# EAGLE design Actuator_Control_board (EAGLE 8.5.1)
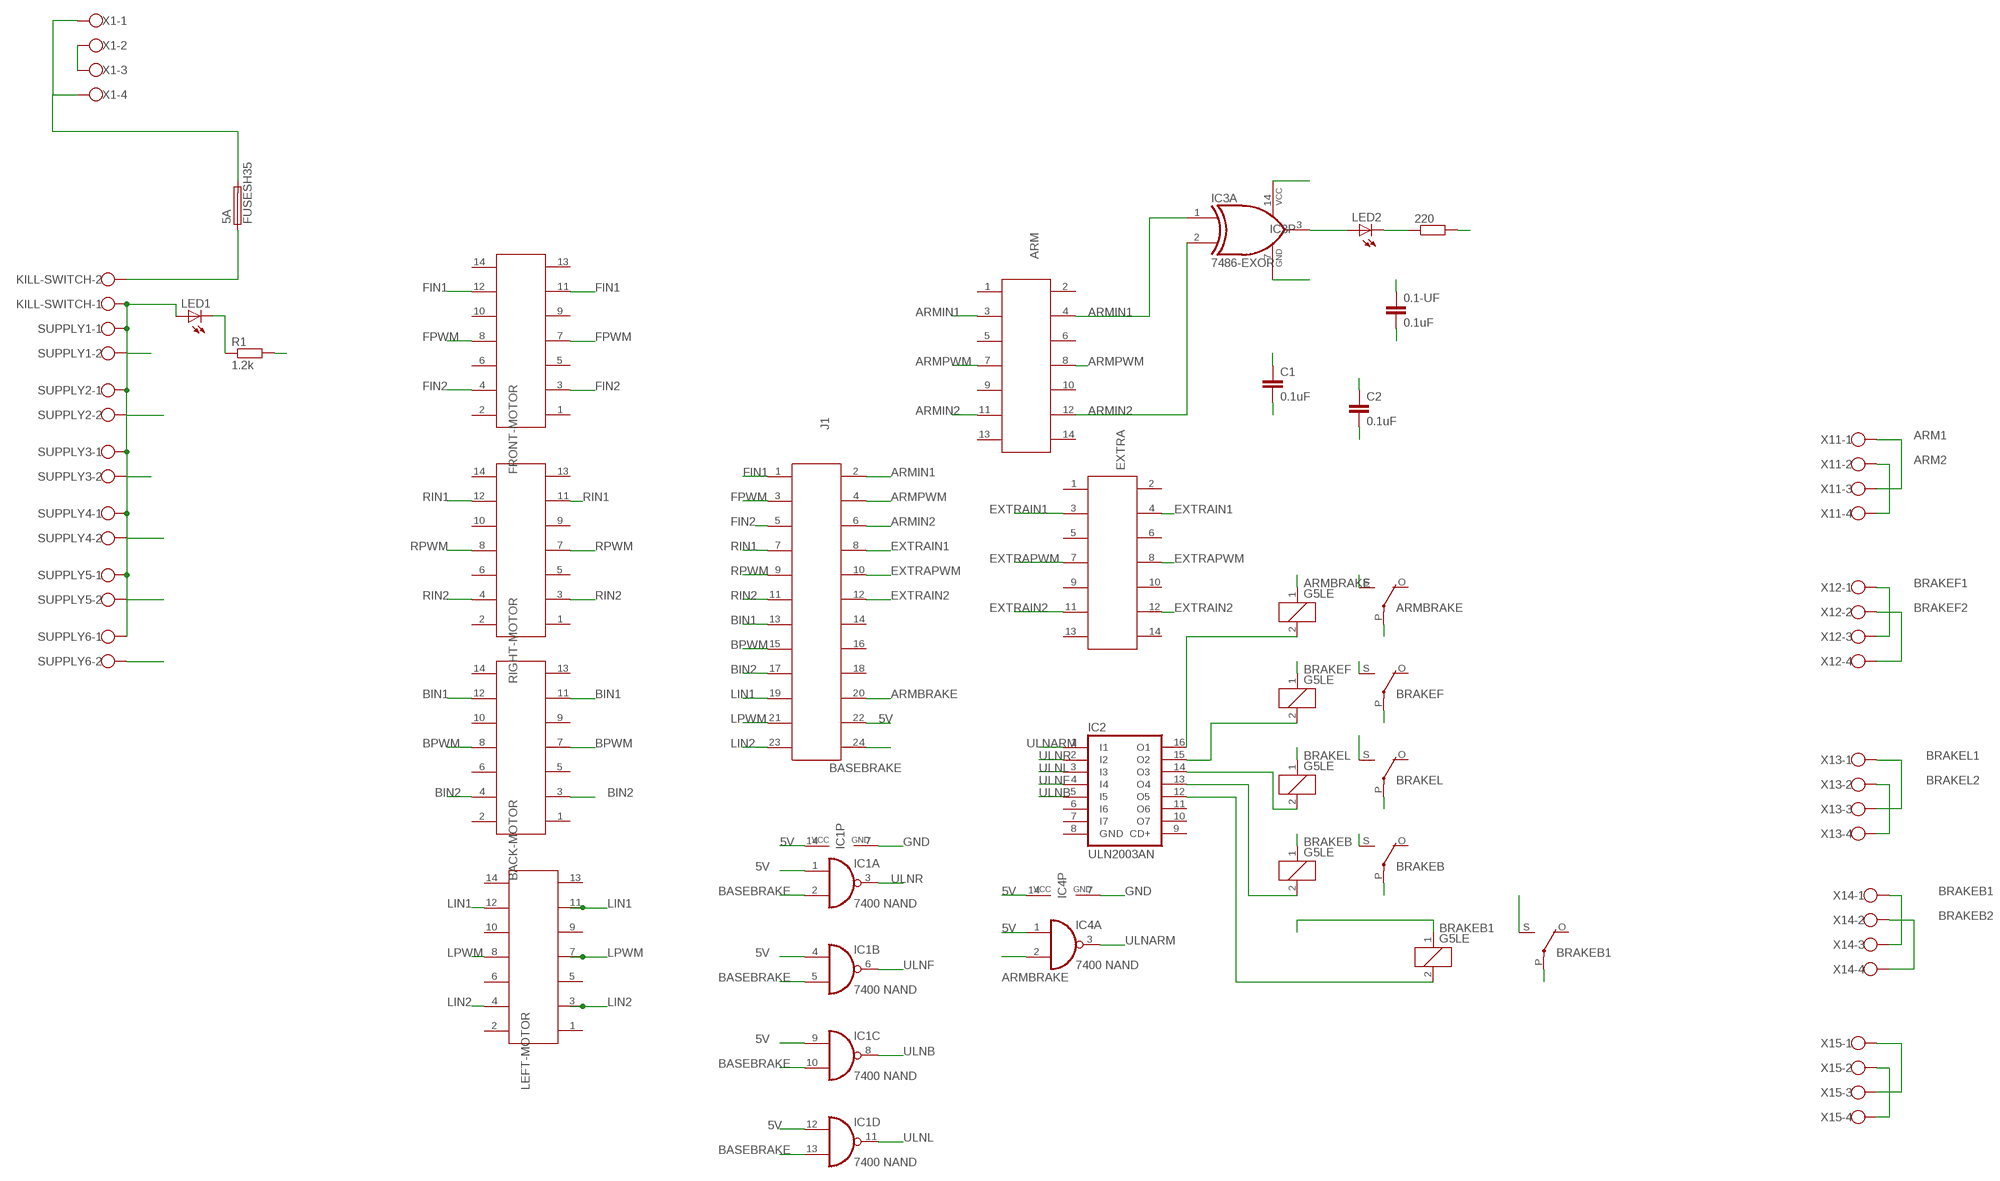
[diagram p0: schematic, sheet 1]

## Parts
0.1-UF  0.1uF  C5/2.5  [C5B2.5]
5A  FUSESH35  [SH25]
220  R-EU_0207/10  [0207/10]
ARM  61201421621  [61201421621]
ARMBRAKE  G5LE  [G5LE]
BACK-MOTOR  61201421621  [61201421621]
BRAKEB  G5LE  [G5LE]
BRAKEB1  G5LE  [G5LE]
BRAKEF  G5LE  [G5LE]
BRAKEL  G5LE  [G5LE]
C1  0.1uF  C5/2.5  [C5B2.5]
C2  0.1uF  C5/2.5  [C5B2.5]
EXTRA  61201421621  [61201421621]
FRONT-MOTOR  61201421621  [61201421621]
IC1  7400 NAND  74AC00N  [DIL14]
IC2  ULN2003AN  [DIL16]
IC3  7486-EXOR  74LS86N  [DIL14]
IC4  7400 NAND  74AC00N  [DIL14]
J1  61202421621  [61202421621]
KILL-SWITCH  W237-102  [W237-102]
LED1  LED5MM  [LED5MM]
LED2  LED5MM  [LED5MM]
LEFT-MOTOR  61201421621  [61201421621]
R1  1.2k  R-EU_0617/17  [0617/17]
RIGHT-MOTOR  61201421621  [61201421621]
SUPPLY1  W237-102  [W237-102]
SUPPLY2  W237-102  [W237-102]
SUPPLY3  W237-102  [W237-102]
SUPPLY4  W237-102  [W237-102]
SUPPLY5  W237-102  [W237-102]
SUPPLY6  W237-102  [W237-102]
X1  W237-4  [W237-4]
X11  W237-4  [W237-4]
X12  W237-4  [W237-4]
X13  W237-4  [W237-4]
X14  W237-4  [W237-4]
X15  W237-4  [W237-4]

## Nets
5V: 0.1-UF.1 ARMBRAKE.1 BRAKEB1.1 BRAKEB.1 BRAKEF.1 BRAKEL.1 C1.1 C2.1 IC1.1(A:I0) IC1.4(B:I0) IC1.9(C:I0) IC1.12(D:I0) IC1.14(P:VCC) IC3.14(P:VCC) IC4.1(A:I0) IC4.14(P:VCC) J1.22
ARM1: ARMBRAKE.P(2:P) X11.1 X11.3
ARM2: ARMBRAKE.S(2:S) X11.2 X11.4
ARMBRAKE: IC4.2(A:I1) J1.20
ARMIN1: ARM.3 ARM.4 IC3.1(A:I0) J1.2
ARMIN2: ARM.11 ARM.12 IC3.2(A:I1) J1.6
ARMPWM: ARM.7 ARM.8 J1.4
BASEBRAKE: IC1.2(A:I1) IC1.5(B:I1) IC1.10(C:I1) IC1.13(D:I1) J1.24
BIN1: BACK-MOTOR.11 BACK-MOTOR.12 J1.13
BIN2: BACK-MOTOR.3 BACK-MOTOR.4 J1.17
BPWM: BACK-MOTOR.7 BACK-MOTOR.8 J1.15
BRAKEB1: BRAKEB.P(2:P) X14.1 X14.3
BRAKEB2: BRAKEB.S(2:S) X14.2 X14.4
BRAKEF1: BRAKEF.P(2:P) X12.1 X12.3
BRAKEF2: BRAKEF.S(2:S) X12.2 X12.4
BRAKEL1: BRAKEL.P(2:P) X13.1 X13.3
BRAKEL2: BRAKEL.S(2:S) X13.2 X13.4
BRAKER1: BRAKEB1.P(2:P) X15.1 X15.3
BRAKER2: BRAKEB1.S(2:S) X15.2 X15.4
EXTRAIN1: EXTRA.3 EXTRA.4 J1.8
EXTRAIN2: EXTRA.11 EXTRA.12 J1.12
EXTRAPWM: EXTRA.7 EXTRA.8 J1.10
FIN1: FRONT-MOTOR.11 FRONT-MOTOR.12 J1.1
FIN2: FRONT-MOTOR.3 FRONT-MOTOR.4 J1.5
FPWM: FRONT-MOTOR.7 FRONT-MOTOR.8 J1.3
GND: 0.1-UF.2 220.2 C1.2 C2.2 IC1.7(P:GND) IC3.7(P:GND) IC4.7(P:GND) R1.2 SUPPLY1.2 SUPPLY2.2 SUPPLY3.2 SUPPLY4.2 SUPPLY5.2 SUPPLY6.2 X1.2 X1.3
LIN1: J1.19 LEFT-MOTOR.11 LEFT-MOTOR.12
LIN2: J1.23 LEFT-MOTOR.3 LEFT-MOTOR.4
LPWM: J1.21 LEFT-MOTOR.7 LEFT-MOTOR.8
N$1: ARMBRAKE.2 IC2.16(O1)
N$2: BRAKEF.2 IC2.15(O2)
N$3: BRAKEL.2 IC2.14(O3)
N$5: BRAKEB.2 IC2.13(O4)
N$6: BRAKEB1.2 IC2.12(O5)
N$8: 5A.2 X1.1 X1.4
N$9: 5A.1 KILL-SWITCH.2
N$10: KILL-SWITCH.1 LED1.A SUPPLY1.1 SUPPLY2.1 SUPPLY3.1 SUPPLY4.1 SUPPLY5.1 SUPPLY6.1
N$11: LED1.K(C) R1.1
N$12: IC3.3(A:O) LED2.A
N$13: 220.1 LED2.K(C)
RIN1: J1.7 RIGHT-MOTOR.11 RIGHT-MOTOR.12
RIN2: J1.11 RIGHT-MOTOR.3 RIGHT-MOTOR.4
RPWM: J1.9 RIGHT-MOTOR.7 RIGHT-MOTOR.8
ULNARM: IC2.1(I1) IC4.3(A:O)
ULNB: IC1.8(C:O) IC2.5(I5)
ULNF: IC1.6(B:O) IC2.4(I4)
ULNL: IC1.11(D:O) IC2.3(I3)
ULNR: IC1.3(A:O) IC2.2(I2)
Unconnected: ARM.1 ARM.2 ARM.5 ARM.6 ARM.9 ARM.10 ARM.13 ARM.14 ARMBRAKE.O(2:O) BACK-MOTOR.1 BACK-MOTOR.2 BACK-MOTOR.5 BACK-MOTOR.6 BACK-MOTOR.9 BACK-MOTOR.10 BACK-MOTOR.13 BACK-MOTOR.14 BRAKEB1.O(2:O) BRAKEB.O(2:O) BRAKEF.O(2:O) BRAKEL.O(2:O) EXTRA.1 EXTRA.2 EXTRA.5 EXTRA.6 EXTRA.9 EXTRA.10 EXTRA.13 EXTRA.14 FRONT-MOTOR.1 FRONT-MOTOR.2 FRONT-MOTOR.5 FRONT-MOTOR.6 FRONT-MOTOR.9 FRONT-MOTOR.10 FRONT-MOTOR.13 FRONT-MOTOR.14 IC2.6(I6) IC2.7(I7) IC2.9(CD+) IC2.10(O7) IC2.11(O6) IC3.4(B:I0) IC3.5(B:I1) IC3.6(B:O) IC3.8(C:O) IC3.9(C:I0) IC3.10(C:I1) IC3.11(D:O) IC3.12(D:I0) IC3.13(D:I1) IC4.4(B:I0) IC4.5(B:I1) IC4.6(B:O) IC4.8(C:O) IC4.9(C:I0) IC4.10(C:I1) IC4.11(D:O) IC4.12(D:I0) IC4.13(D:I1) J1.14 J1.16 J1.18 LEFT-MOTOR.1 LEFT-MOTOR.2 LEFT-MOTOR.5 LEFT-MOTOR.6 LEFT-MOTOR.9 LEFT-MOTOR.10 LEFT-MOTOR.13 LEFT-MOTOR.14 RIGHT-MOTOR.1 RIGHT-MOTOR.2 RIGHT-MOTOR.5 RIGHT-MOTOR.6 RIGHT-MOTOR.9 RIGHT-MOTOR.10 RIGHT-MOTOR.13 RIGHT-MOTOR.14

## Power pins joined to a net without a drawn wire
GND: IC2.8(GND)

## Library data of the parts
0.1-UF C1 C2 = capacitor-wima:C: CAPACITOR naming: grid - package width
5A = fuse:FUSE: Fuse; OC_FARNELL: unknown; OC_NEWARK: unknown
220 R1 = resistor:R-EU_: RESISTOR, European symbol
ARM BACK-MOTOR EXTRA FRONT-MOTOR LEFT-MOTOR RIGHT-MOTOR = Wurth_Elektronik_Electromechanic_Wire_to_Board_Connectors_rev17b:61201421621: WR-BHD 2.54mm Male Box Header, 14 Pins=>Code : Con_WTB_BHD_2.54_Male_THT_WS_61201421621 <http://katalog.we-online.de/media/thumbs2/eican/thb_Con_WTB_BHD_2.54_Male_THT_WS_6120xx21621_pf2.jpg> Details see: http://katalog.we-online.de/en/em/612_0xx_216_21 Created 2014-06-04, Karrer Zheng 2014 (C) Würth Elektronik
ARMBRAKE BRAKEB BRAKEB1 BRAKEF BRAKEL = relay:G5LE: RELAY 1 x switch, 10 A/120 V AC, 8 A/30 V DC, Omron; OC_FARNELL: unknown; OC_NEWARK: unknown
IC1 IC4 = 74xx-eu:74*00: Quad 2-input NAND gate
IC2 = uln-udn:ULN2003A: DRIVER ARRAY
IC3 = 74xx-us:74*86: Quad 2-input EXCLUSIV-OR (XOR) gate
J1 = Wurth_Elektronik_Electromechanic_Wire_to_Board_Connectors_rev17b:61202421621: WR-BHD 2.54mm Male Box Header, 24 Pins=>Code : Con_WTB_BHD_2.54_Male_THT_WS_61202421621 <http://katalog.we-online.de/media/thumbs2/eican/thb_Con_WTB_BHD_2.54_Male_THT_WS_6120xx21621_pf2.jpg> Details see: http://katalog.we-online.de/en/em/612_0xx_216_21 Created 2014-06-04, Karrer Zheng 2014 (C) Würth Elektronik
KILL-SWITCH SUPPLY1-SUPPLY6 = con-wago-500:W237-102: WAGO SCREW CLAMP; MPN: 237-102; OC_FARNELL: unknown; OC_NEWARK: 70K9898
LED1 LED2 = led:LED: LED OSRAM: - CHIPLED LG R971, LG N971, LY N971, LG Q971, LY Q971, LO R971, LY R971 LH N974, LH R974 LS Q976, LO Q976, LY Q976 LO Q996 - Hyper CHIPLED LW Q18S LB Q993, LB Q99A, LB R99A - SideLED LS A670, LO A670, LY A670, LG A670, LP A670 LB A673, LV A673, LT A673, LW A673 LH A674 LY A675 LS A676, LA A676, LO A676, LY A676, LW A676 LS A679, LY A679, LG A679 - Hyper Micro SIDELED® LS Y876, LA Y876, LO Y876, LY Y876 LT Y87S - SmartLED LW L88C, LW L88S LB L89C, LB L89S, LG L890 LS L89K, LO L89K, LY L89K LS L896, LA L896, LO L896, LY L896 - TOPLED LS T670, LO T670, LY T670, LG T670, LP T670 LSG T670, LSP T670, LSY T670, LOP T670, LYG T670 LG T671, LOG T671, LSG T671 LB T673, LV T673, LT T673, LW T673 LH T674 LS T676, LA T676, LO T676, LY T676, LB T676, LH T676, LSB T676, LW T676 LB T67C, LV T67C, LT T67C, LS T67K, LO T67K, LY T67K, LW E67C LS E67B, LA E67B, LO E67B, LY E67B, LB E67C, LV E67C, LT E67C LW T67C LS T679, LY T679, LG T679 LS T770, LO T770, LY T770, LG T770, LP T770 LB T773, LV T773, LT T773, LW T773 LH T774 LS E675, LA E675, LY E675, LS T675 LS T776, LA T776, LO T776, LY T776, LB T776 LHGB T686 LT T68C, LB T68C - Hyper Mini TOPLED® LB M676 - Mini TOPLED Santana® LG M470 LS M47K, LO M47K, LY M47K Source: http://www.osram.convergy.de LUXEON: - LUMILED® LXK2-PW12-R00, LXK2-PW12-S00, LXK2-PW14-U00, LXK2-PW14-V00 LXK2-PM12-R00, LXK2-PM12-S00, LXK2-PM14-U00 LXK2-PE12-Q00, LXK2-PE12-R00, LXK2-PE12-S00, LXK2-PE14-T00, LXK2-PE14-U00 LXK2-PB12-K00, LXK2-PB12-L00, LXK2-PB12-M00, LXK2-PB14-N00, LXK2-PB14-P00, LXK2-PB14-Q00 LXK2-PR12-L00, LXK2-PR12-M00, LXK2-PR14-Q00, LXK2-PR14-R00 LXK2-PD12-Q00, LXK2-PD12-R00, LXK2-PD12-S00 LXK2-PH12-R00, LXK2-PH12-S00 LXK2-PL12-P00, LXK2-PL12-Q00, LXK2-PL12-R00 Source: www.luxeon.com KINGBRIGHT: KA-3528ASYC Source: www.kingbright.com
X1 X11-X15 = con-wago-500:W237-4: WAGO SCREW CLAMP; OC_FARNELL: unknown; OC_NEWARK: unknown

## Board
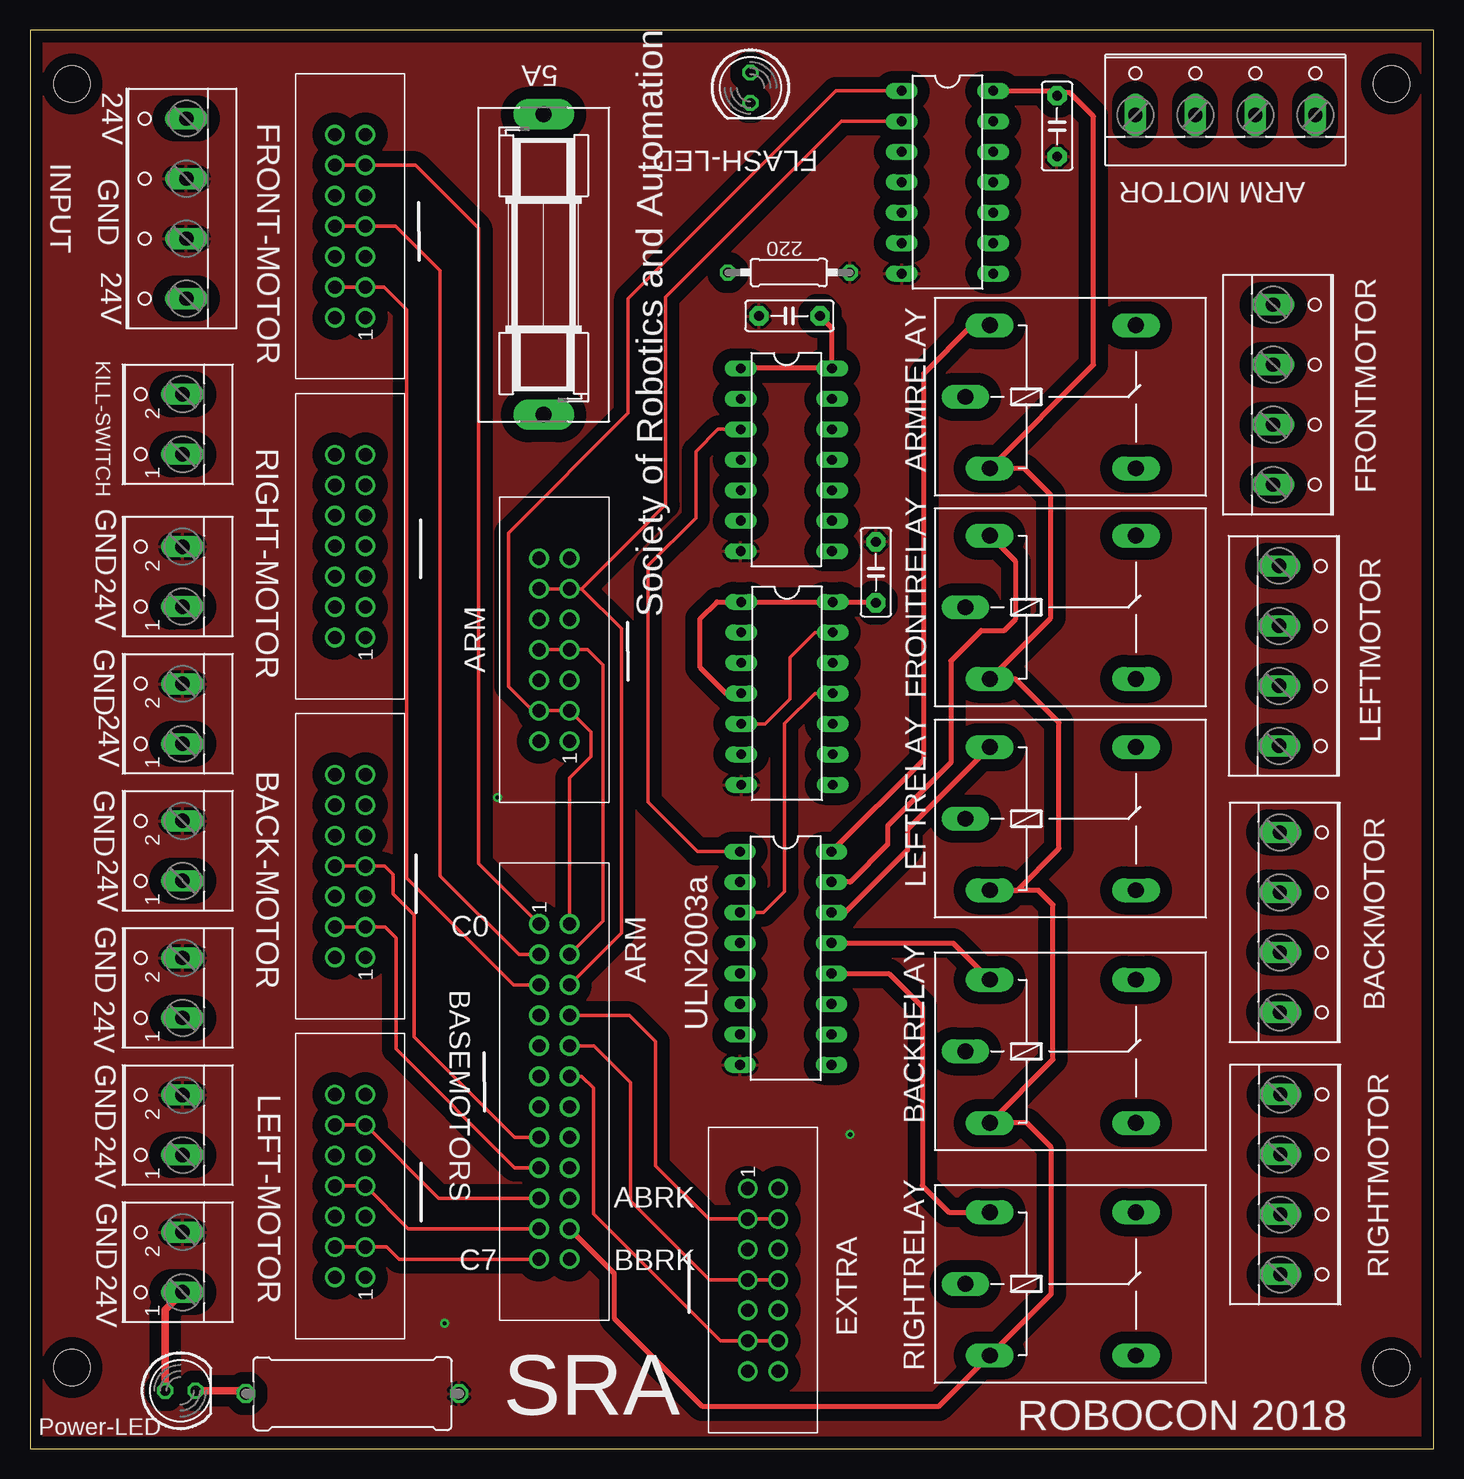
[diagram p1: board, top side]
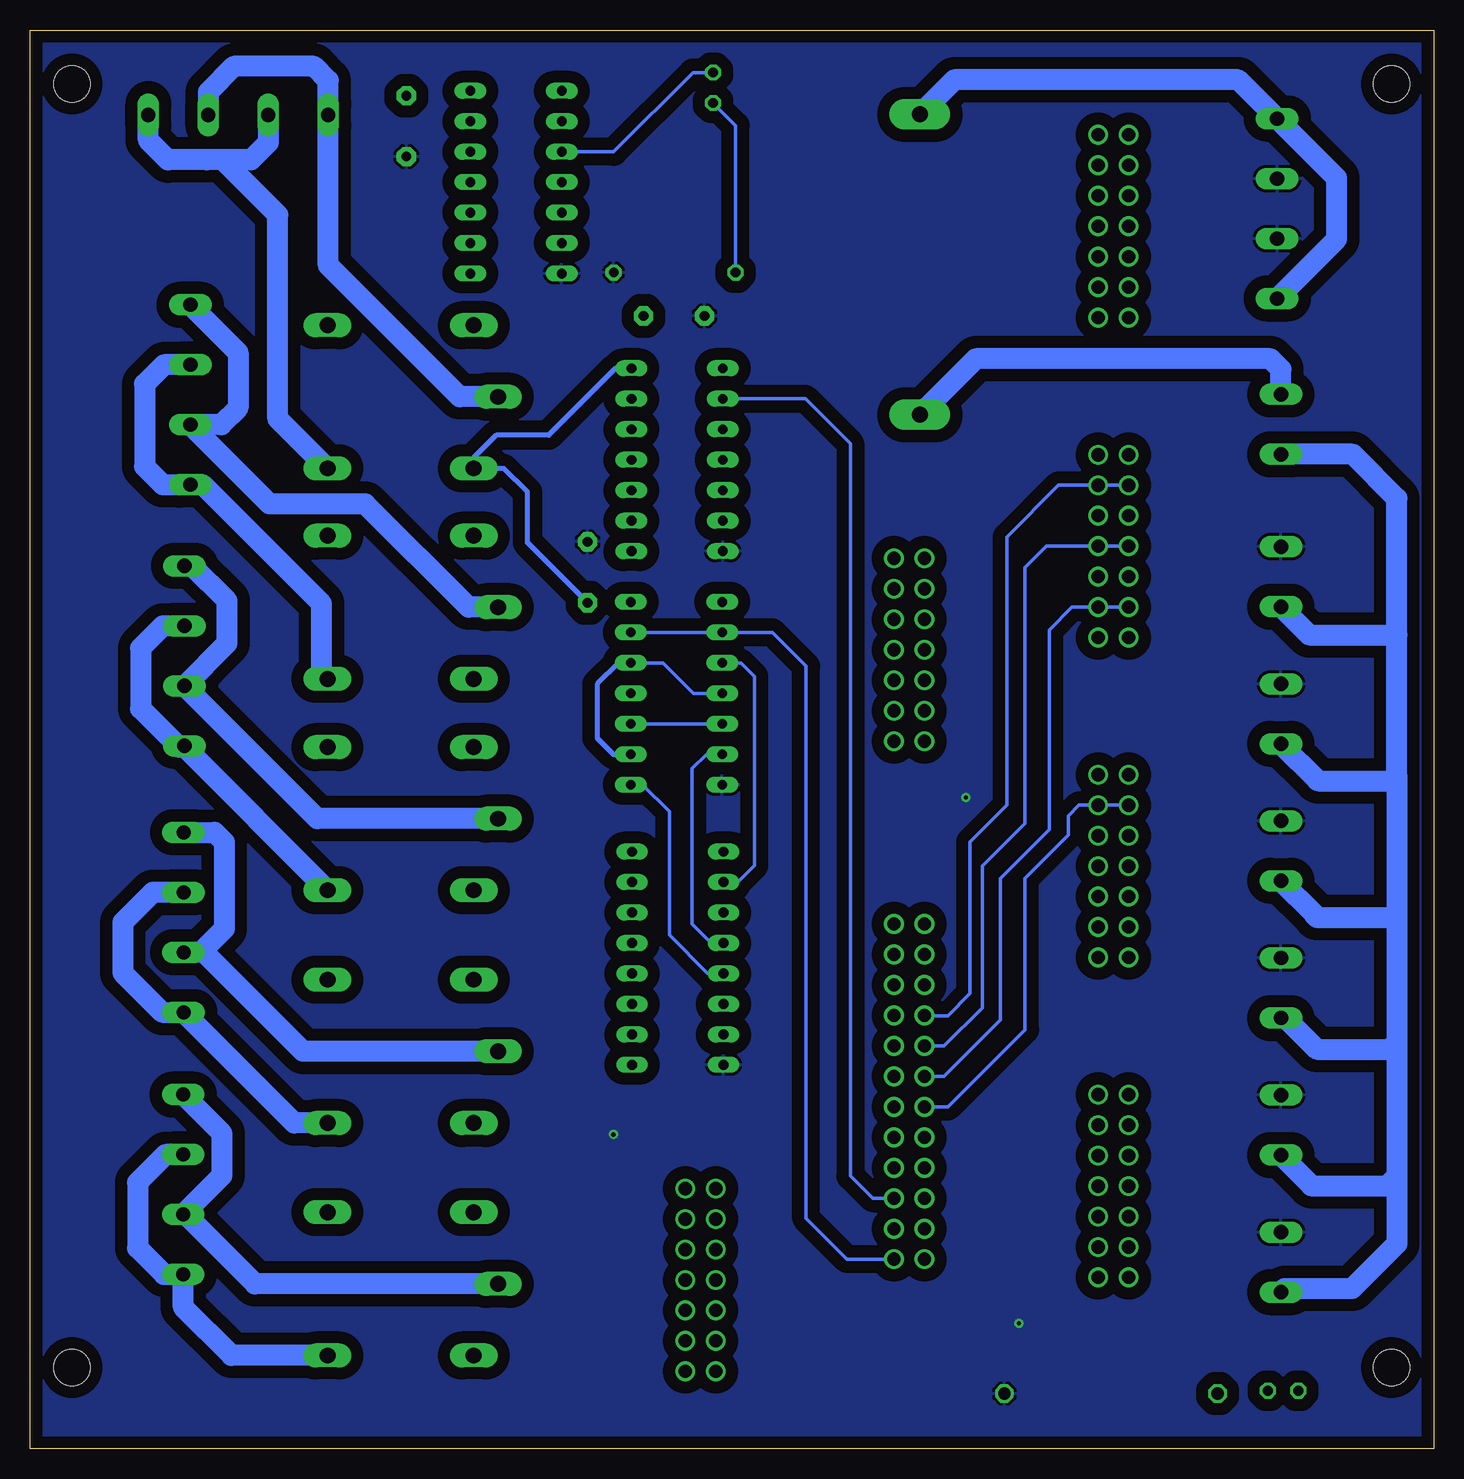
[diagram p2: board, bottom side, seen from below]

Size 117 x 118.25 mm. Coordinates in mm from the lower left corner, seen from the top.
Outline: 0,0 117,0 117,118.25 0,118.25 0,0
Copper layers (1*16): Top 0.035mm / dielectric 1.5mm / Bottom 0.035mm
Design rules "default *": minimum track width 6mil, minimum drill 0.35mm, track to track 20mil, track to pad 20mil, pad to pad 6mil, via to via 15mil, smd to smd 6mil, copper to edge 40mil, drill to drill 6mil, minimum pad ring 10mil, minimum via ring 8mil, stop-mask expansion 4mil, vias tented up to drill 0mil, thermal gap 10mil
Holes 3 mm at 3.5,113.75 3.5,6.75 113.5,6.75 113.5,113.75

### Footprints (pad centres in the part's own frame; a part is rotated, then mirrored left to right if it is on the bottom)
C5B2.5 = drill 0.813 pad 1.6 octagon: 1 -2.54,0; 2 2.54,0
SH25 = drill 1.321 pad 2.54 long: 1 -12.522,0; 2 12.522,0
0207/10 = drill 0.813 octagon: 1 -5.08,0; 2 5.08,0
61201421621 = drill 1.1: 1 -7.62,-1.27; 2 -7.62,1.27; 3 -5.08,-1.27; 4 -5.08,1.27; 5 -2.54,-1.27; 6 -2.54,1.27; 7 0,-1.27; 8 0,1.27; 9 2.54,-1.27; 10 2.54,1.27; 11 5.08,-1.27; 12 5.08,1.27; 13 7.62,-1.27; 14 7.62,1.27
G5LE = drill 1.321 long: 1 -7.493,-5.969; 2 -7.493,5.969; O 4.699,5.969; P -9.525,0; S 4.699,-5.969
DIL14 = drill 0.813 long: 1 -7.62,-3.81; 2 -5.08,-3.81; 3 -2.54,-3.81; 4 0,-3.81; 5 2.54,-3.81; 6 5.08,-3.81; 7 7.62,-3.81; 8 7.62,3.81; 9 5.08,3.81; 10 2.54,3.81; 11 0,3.81; 12 -2.54,3.81; 13 -5.08,3.81; 14 -7.62,3.81
DIL16 = drill 0.813 long: 1 -8.89,-3.81; 2 -6.35,-3.81; 3 -3.81,-3.81; 4 -1.27,-3.81; 5 1.27,-3.81; 6 3.81,-3.81; 7 6.35,-3.81; 8 8.89,-3.81; 9 8.89,3.81; 10 6.35,3.81; 11 3.81,3.81; 12 1.27,3.81; 13 -1.27,3.81; 14 -3.81,3.81; 15 -6.35,3.81; 16 -8.89,3.81
61202421621 = drill 1.1: 1 -13.97,-1.27; 2 -13.97,1.27; 3 -11.43,-1.27; 4 -11.43,1.27; 5 -8.89,-1.27; 6 -8.89,1.27; 7 -6.35,-1.27; 8 -6.35,1.27; 9 -3.81,-1.27; 10 -3.81,1.27; 11 -1.27,-1.27; 12 -1.27,1.27; 13 1.27,-1.27; 14 1.27,1.27; 15 3.81,-1.27; 16 3.81,1.27; 17 6.35,-1.27; 18 6.35,1.27; 19 8.89,-1.27; 20 8.89,1.27; 21 11.43,-1.27; 22 11.43,1.27; 23 13.97,-1.27; 24 13.97,1.27
W237-102 = drill 1.194 long: 1 -2.5,-1.27; 2 2.5,-1.27
LED5MM = drill 0.813 octagon: A -1.27,0; K 1.27,0
0617/17 = drill 1.016 octagon: 1 -8.89,0; 2 8.89,0
W237-4 = drill 1.194 long: 1 -7.5,-1.27; 2 -2.5,-1.27; 3 2.5,-1.27; 4 7.5,-1.27

### Placement (x,y rotation side)
0.1-UF  85.62,110.24 270 top
5A  42.82,98.7 90 top
220  63.26,98.03 0 top
ARM  43.71,66.58 90 top
ARMBRAKE  87.5,87.67 0 top
BACK-MOTOR  26.69,48.55 90 top
BRAKEB  87.5,33.11 0 top
BRAKEB1  87.5,13.72 0 top
BRAKEF  87.5,70.13 0 top
BRAKEL  87.5,52.51 0 top
C1  63.31,94.41 180 top
C2  70.52,73.04 90 top
EXTRA  61.1,14.05 270 top
FRONT-MOTOR  26.69,101.89 90 top
IC1  63.1,62.95 270 top
IC2  63,40.87 270 top
IC3  76.48,105.56 270 top
IC4  63.05,82.42 270 top
J1  43.71,29.75 270 top
KILL-SWITCH  11.45,85.38 90 top
LED1  12.54,4.82 0 top
LED2  60.06,113.43 270 top
LEFT-MOTOR  26.69,21.88 90 top
R1  26.89,4.58 0 top
RIGHT-MOTOR  26.69,75.22 90 top
SUPPLY1  11.45,72.68 90 top
SUPPLY2  11.45,61.25 90 top
SUPPLY3  11.45,49.82 90 top
SUPPLY4  11.45,38.39 90 top
SUPPLY5  11.45,26.96 90 top
SUPPLY6  11.45,15.53 90 top
X1  11.77,103.36 90 top
X11  99.64,112.44 0 top
X12  104.91,87.85 270 top
X13  105.39,66.08 270 top
X14  105.46,43.86 270 top
X15  105.5,22.01 270 top

### Tracks (layer width: path | path; a pad name or v marks a point on that pad's centre or on a via)
5V
  Top 0.406: IC3.14 85.22,113.18 85.38,113.02 | 85.38,113.02 0.1-UF.1 | 59.33,62.99 IC1.4 58.02,62.95 55.86,65.11 55.86,69.18 57.25,70.57 IC1.1 IC1.14 70.45,70.57 C2.1 | IC4.1 IC4.14 66.86,93.4 C1.1 | 85.38,113.02 86.68,113.02 88.65,111.05 88.65,90.34 ARMBRAKE.1 82.88,81.7 85.09,79.5 85.09,69.24 BRAKEF.1 82.13,64.16 85.78,60.51 85.78,50.02 82.29,46.54 BRAKEL.1 84.08,46.54 85.29,45.33 85.29,32.42 BRAKEB.1 83.09,27.14 85.14,25.1 85.14,12.88 BRAKEB1.1 75.79,3.54 56.02,3.54 48.7,10.86 48.7,14.6 J1.22
  Bottom 0.305: IC1.4 61.69,62.95 64.23,65.49 IC1.12
  Bottom 0.406: IC1.12 67.93,65.49 69.71,63.71 69.71,59.23 68.36,57.87 IC1.9 | C2.1 75.53,75.52 75.53,79.73 77.5,81.7 ARMBRAKE.1 80.01,82.59 78.13,84.46 73.77,84.46 68.18,90.04 IC4.14
ARM1
  Bottom 1.77: X11.3 102.14,113.08 100,115.21 93.32,115.21 92.14,114.03 X11.1 92.14,98.63 81.19,87.67 ARMBRAKE.P
ARM2
  Bottom 1.77: X11.2 97.14,108.86 98.56,107.43 100.93,107.43 | X11.4 107.14,109.07 105.48,107.42 105.47,107.43 102.25,107.43 100.93,107.43 | ARMBRAKE.S 96.34,85.85 96.34,102.84 100.93,107.43
ARMBRAKE
  Bottom 0.305: IC4.2 52.36,87.5 48.61,83.75 48.61,22.73 47.39,21.51 46.74,20.86 J1.20
ARMIN1
  Top 0.254: 42.51,61.5 ARM.4
  Top 0.305: J1.2 44.98,55.92 46.76,57.69 46.76,59.73 ARM.3 42.51,61.5 41.9,61.5 39.88,63.52 39.88,76.33 49.86,86.31 49.86,95.87 67.17,113.18 IC3.1
ARMIN2
  Top 0.305: ARM.12 ARM.11 45.99,71.66 | J1.6 49.3,42.96 49.3,68.36 45.99,71.66 | 45.99,71.66 50.72,76.39 50.72,76.4 53,78.67 53,96 67.64,110.64 IC3.2
ARMPWM
  Top 0.305: ARM.8 ARM.7 46.48,66.58 47.77,65.3 47.77,43.98 J1.4
BASEBRAKE
  Top 0.305: IC1.13 65.44,68.03 63.34,65.93 63.34,62.48 61.27,60.41 IC1.5
  Bottom 0.305: IC1.13 IC1.2 55.11,68.03 52.3,65.22 52.3,19.21 48.88,15.78 J1.24 | IC1.5 IC1.10
BIN1
  Bottom 0.305: BACK-MOTOR.12 BACK-MOTOR.11 29.55,53.63 30.45,52.72 30.45,51.14 34.06,47.53 34.06,34.91 40.49,28.48 J1.13
BIN2
  Top 0.305: BACK-MOTOR.4 BACK-MOTOR.3 29.59,43.47 30.5,42.56 30.5,33.31 40.41,23.4 J1.17
BPWM
  Top 0.305: BACK-MOTOR.8 BACK-MOTOR.7 29.55,48.55 30.26,47.84 30.26,46.25 32.02,44.49 32.02,34.3 40.38,25.94 J1.15
BRAKEB1
  Bottom 1.77: BRAKEB.P 94.24,33.11 102.49,41.36 X14.3 102.77,41.36 100.8,43.32 100.8,50.55 101.61,51.36 X14.1
BRAKEB2
  Bottom 1.77: BRAKEB.S 94.98,27.14 X14.4 105.97,36.36 109.27,39.66 109.27,43.85 106.77,46.36 X14.2
BRAKEF1
  Bottom 1.77: X12.1 99.65,91.36 99.65,86.74 101.04,85.35 X12.3 97.03,78.75 89.06,78.75 80.44,70.13 BRAKEF.P
BRAKEF2
  Bottom 1.77: X12.2 105.83,90.35 107.45,88.73 107.45,81.87 105.93,80.35 X12.4 102.61,80.35 92.69,70.44 92.69,64.65 BRAKEF.S
BRAKEL1
  Bottom 1.77: BRAKEL.P 93.05,52.51 X13.3 100.58,67.13 100.58,70.67 103.48,73.58 X13.1
BRAKEL2
  Bottom 1.77: BRAKEL.S 104.12,58.46 | 104.12,58.46 X13.4 | X13.2 105.94,68.58 107.79,66.72 107.79,61.68 104.57,58.46 104.12,58.46
BRAKER1
  Bottom 1.77: BRAKEB1.P 98.25,13.72 104.04,19.52 X15.3 100.98,22.76 100.98,26.27 X15.1
BRAKER2
  Bottom 1.77: BRAKEB1.S 100.2,7.75 104.23,11.78 X15.4 105.83,14.52 108.04,16.72 108.04,22.18 105.71,24.52 X15.2
EXTRAIN1
  Top 0.305: EXTRA.4 EXTRA.3 56.58,19.13 52.15,23.57 52.15,33.93 49.97,36.1 J1.8
EXTRAIN2
  Top 0.305: EXTRA.12 EXTRA.11 57.57,8.97 46.96,19.58 46.96,30.06 45.99,31.02 J1.12
EXTRAPWM
  Top 0.305: EXTRA.8 EXTRA.7 | EXTRA.7 59.69,14.05 | J1.10 47.04,33.56 50.08,30.53 50.08,20.63 56.66,14.05 EXTRA.7
FIN1
  Top 0.305: FRONT-MOTOR.12 FRONT-MOTOR.11 32.15,106.97 37.39,101.72 37.39,48.77 J1.1
FIN2
  Top 0.305: FRONT-MOTOR.4 FRONT-MOTOR.3 29.53,96.81 31.41,94.93 31.41,47.55 40.32,38.64 J1.5
FPWM
  Top 0.305: FRONT-MOTOR.8 FRONT-MOTOR.7 30.49,101.89 34.2,98.18 34.2,47.74 40.76,41.18 J1.3
GND  (via drill 0.35)
  other vias: 34.56,10.45 38.99,54.27 68.37,26.17
  pour Top (isolate 1.016): 0.5,117.75 116.5,117.75 116.5,0.5 0.5,0.5
  pour Bottom (isolate 1.016): 0.5,117.75 116.5,117.75 116.5,0.5 0.5,0.5
LIN1
  Top 0.305: LEFT-MOTOR.12 LEFT-MOTOR.11 34.06,20.86 J1.19
LIN2
  Top 0.305: LEFT-MOTOR.4 LEFT-MOTOR.3 29.74,16.8 30.75,15.78 J1.23
LPWM
  Top 0.305: LEFT-MOTOR.8 LEFT-MOTOR.7 31.52,18.32 J1.21
N$1
  Top 0.406: IC2.16 74.51,57.45 74.51,89.61 78.53,93.64 ARMBRAKE.2
N$2
  Top 0.406: BRAKEF.2 82.17,73.93 82.17,69.15 81.23,68.21 79.31,68.21 76.76,65.66 76.76,57.17 71.5,51.91 71.5,50.34 68.38,47.22 IC2.15
N$3
  Top 0.406: IC2.14 67.94,44.68 73.19,49.92 73.19,51.65 BRAKEL.2
N$5
  Top 0.406: IC2.13 76.95,42.14 BRAKEB.2
N$6
  Top 0.406: IC2.12 71.6,39.6 74.38,36.82 74.38,21.9 76.59,19.69 BRAKEB1.2
N$8
  Bottom 1.77: 5A.2 39.95,114.1 16.28,114.1 X1.4 8.08,105.9 8.08,100.81 X1.1
N$9
  Bottom 1.77: KILL-SWITCH.2 12.72,89.97 13.6,90.85 38.15,90.85 5A.1
N$10
  Top 0.61: SUPPLY6.1 11.27,11.58 LED1.A
  Bottom 1.77: SUPPLY6.1 12.47,13.28 arc45 12.29,13.35 6.78,13.35 3.12,17.01 arc-45 3.04,17.19 3.04,22.68 | 3.04,33.86 3.04,22.68 | 3.04,44.27 3.04,33.86 | 3.04,56.04 3.04,44.27 | 3.04,56.04 3.04,67.82 | 3.04,67.82 3.04,79.2 6.65,82.81 arc-45 6.83,82.88 KILL-SWITCH.1 | SUPPLY1.1 10.43,67.89 arc-45 10.25,67.82 3.04,67.82 | SUPPLY5.1 10.23,21.96 arc-45 10.05,21.89 3.93,21.89 arc-45 3.75,21.96 3.04,22.68 | SUPPLY4.1 12.43,35.89 arc45 12.25,35.82 9.71,33.27 3.74,33.27 arc-45 3.56,33.35 3.04,33.86 | SUPPLY3.1 9.94,44.54 arc45 9.91,44.46 9.79,44.34 arc-45 9.61,44.27 3.04,44.27 | SUPPLY2.1 9.69,55.72 arc-45 9.52,55.65 3.54,55.65 arc-45 3.36,55.72 3.04,56.04
N$11
  Top 0.61: LED1.K 17.75,4.82 R1.1
N$12
  Bottom 0.305: LED2.A 61.74,114.7 68.34,108.1 IC3.3
N$13
  Bottom 0.305: 220.1 58.18,110.29 LED2.K
RIN1
  Bottom 0.305: RIGHT-MOTOR.12 RIGHT-MOTOR.11 31.26,80.3 35.58,75.98 35.58,53.63 38.63,50.58 38.63,37.93 40.49,36.07 42.4,36.07 J1.7
RIN2
  Bottom 0.305: RIGHT-MOTOR.4 RIGHT-MOTOR.3 30.13,70.14 32.02,68.24 32.02,51.6 36.09,47.53 36.09,35.73 40.8,31.02 J1.11
RPWM
  Bottom 0.305: RIGHT-MOTOR.8 RIGHT-MOTOR.7 32.28,75.22 34.06,73.44 34.06,52.11 37.61,48.55 37.61,36.75 40.8,33.56 J1.9
ULNARM
  Top 0.305: IC2.1 55.65,49.76 51.53,53.88 51.53,73.59 55.5,77.56 55.5,83.11 57.36,84.96 IC4.3
ULNB
  Bottom 0.305: IC2.5 60.51,39.6 63.71,42.79 63.71,53.11 65.93,55.33 IC1.8
ULNF
  Bottom 0.305: IC1.6 60.6,57.87 61.79,56.68 61.79,43.71 60.22,42.14 IC2.4
ULNL
  Top 0.305: IC1.11 65.44,62.95 62.91,60.43 62.91,46.46 61.14,44.68 IC2.3
ULNR
  Bottom 0.305: IC2.2 57.99,47.22 56.61,48.6 56.61,64.36 57.74,65.49 IC1.3

### Text on the board
tNames: 24V | FLASH-LED | INPUT | GND | ARM MOTOR | 24V | ARMRELAY | FRONTMOTOR | GND | 24V | Society of Robotics and Automation | GND | FRONTRELAY | 24V | LEFTMOTOR | GND | 24V | LEFTRELAY | GND | C0 | BASEMOTORS | ARM | 24V | BACKMOTOR | ULN2003a | GND | BACKRELAY | 24V | GND | ABRK | 24V | C7 | BBRK | RIGHTMOTOR | RIGHTRELAY | ROBOCON 2018 | SRA | Power-LED